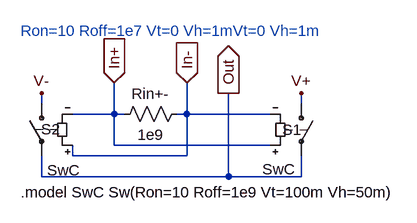
[diagram p0: schematic Comp3.asc]
Comp3.asc, the LTspice schematic file:
Version 4
SHEET 1 880 680
WIRE -112 240 -112 224
WIRE -112 352 -112 320
WIRE -64 320 -64 304
WIRE 0 256 -64 256
WIRE 0 256 0 208
WIRE 0 304 0 256
WIRE 16 256 0 256
WIRE 112 256 96 256
WIRE 112 256 112 208
WIRE 112 320 -64 320
WIRE 112 320 112 256
WIRE 176 352 -112 352
WIRE 176 352 176 224
WIRE 240 256 112 256
WIRE 240 304 0 304
WIRE 288 240 288 224
WIRE 288 352 176 352
WIRE 288 352 288 320
FLAG 0 208 In+
IOPIN 0 208 In
FLAG 112 208 In-
IOPIN 112 208 In
FLAG 176 224 Out
IOPIN 176 224 Out
FLAG -112 224 V-
FLAG 288 224 V+
SYMBOL sw 288 224 R0
WINDOW 0 -29 56 Left 0
WINDOW 3 -60 117 Left 0
SYMATTR InstName S1
SYMATTR Value SwC
SYMBOL sw -112 224 M0
WINDOW 0 -29 55 Left 0
WINDOW 3 -59 118 Left 0
SYMATTR InstName S2
SYMATTR Value SwC
SYMBOL res 112 240 R90
WINDOW 0 0 56 VBottom 0
WINDOW 3 32 56 VTop 0
SYMATTR InstName Rin+-
SYMATTR Value 1e9
TEXT -144 128 Left 0 ;Ron=10 Roff=1e7 Vt=0 Vh=1mVt=0 Vh=1m
TEXT -144 376 Left 0 !.model SwC Sw(Ron=10 Roff=1e9 Vt=100m Vh=50m)

The netlist it stands for:
* Comp3.asc
S1 V+ Out In+ In- SwC
S2 V- Out In- In+ SwC
Rin+- In- In+ 1e9
* Ron=10 Roff=1e7 Vt=0 Vh=1mVt=0 Vh=1m
.model SwC Sw(Ron=10 Roff=1e9 Vt=100m Vh=50m)
.backanno
.end